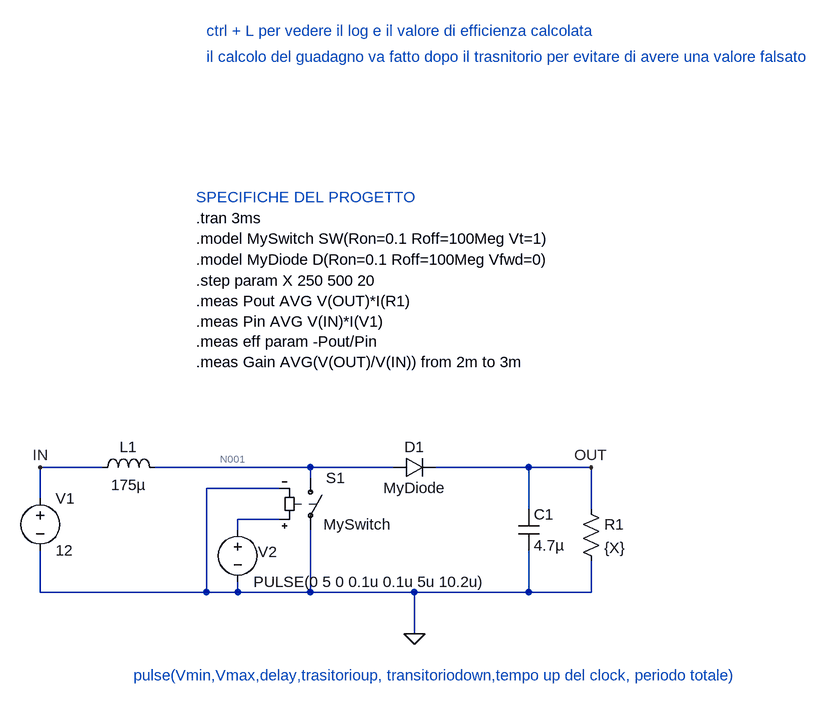
[diagram p0: schematic boost_ideale.asc]
boost_ideale.asc, the LTspice schematic file:
Version 4
SHEET 1 1372 680
WIRE -1552 80 -1648 80
WIRE -1232 80 -1472 80
WIRE -1104 80 -1232 80
WIRE -896 80 -1040 80
WIRE -800 80 -896 80
WIRE -1232 96 -1232 80
WIRE -1280 112 -1392 112
WIRE -1648 128 -1648 80
WIRE -896 144 -896 80
WIRE -800 144 -800 80
WIRE -1280 160 -1344 160
WIRE -1344 176 -1344 160
WIRE -1648 272 -1648 208
WIRE -1392 272 -1392 112
WIRE -1392 272 -1648 272
WIRE -1344 272 -1344 256
WIRE -1344 272 -1392 272
WIRE -1232 272 -1232 176
WIRE -1232 272 -1344 272
WIRE -1072 272 -1232 272
WIRE -896 272 -896 208
WIRE -896 272 -1072 272
WIRE -800 272 -800 224
WIRE -800 272 -896 272
WIRE -1072 336 -1072 272
FLAG -1072 336 0
FLAG -800 80 OUT
FLAG -1648 80 IN
SYMBOL cap -912 144 R0
SYMATTR InstName C1
SYMATTR Value 4.7µ
SYMBOL ind -1568 96 R270
WINDOW 0 32 56 VTop 2
WINDOW 3 5 56 VBottom 2
SYMATTR InstName L1
SYMATTR Value 175µ
SYMBOL diode -1104 96 R270
WINDOW 0 32 32 VTop 2
WINDOW 3 0 32 VBottom 2
SYMATTR InstName D1
SYMATTR Value MyDiode
SYMBOL res -816 128 R0
SYMATTR InstName R1
SYMATTR Value {X}
SYMBOL voltage -1648 112 R0
WINDOW 123 0 0 Left 0
WINDOW 39 0 0 Left 0
SYMATTR InstName V1
SYMATTR Value 12
SYMBOL sw -1232 80 R0
WINDOW 3 20 88 Left 2
SYMATTR InstName S1
SYMATTR Value MySwitch
SYMBOL voltage -1344 160 R0
WINDOW 123 0 0 Left 0
WINDOW 39 0 0 Left 0
WINDOW 0 31 50 Left 2
SYMATTR InstName V2
SYMATTR Value PULSE(0 5 0 0.1u 0.1u 5u 10.2u)
TEXT -1408 -304 Left 2 !.tran 3ms
TEXT -1408 -272 Left 2 !.model MySwitch SW(Ron=0.1 Roff=100Meg Vt=1)
TEXT -1408 -240 Left 2 !.model MyDiode D(Ron=0.1 Roff=100Meg Vfwd=0)
TEXT -1408 -336 Left 2 ;SPECIFICHE DEL PROGETTO
TEXT -1504 400 Left 2 ;pulse(Vmin,Vmax,delay,trasitorioup, transitoriodown,tempo up del clock, periodo totale)
TEXT -1408 -208 Left 2 !.step param X 250 500 20
TEXT -1408 -176 Left 2 !.meas Pout AVG V(OUT)*I(R1)\n.meas Pin AVG V(IN)*I(V1)\n.meas eff param -Pout/Pin\n.meas Gain AVG(V(OUT)/V(IN)) from 2m to 3m
TEXT -1392 -592 Left 2 ;ctrl + L per vedere il log e il valore di efficienza calcolata
TEXT -1392 -552 Left 2 ;il calcolo del guadagno va fatto dopo il trasnitorio per evitare di avere una valore falsato

The netlist it stands for:
* boost_ideale.asc
C1 OUT 0 4.7µ
L1 IN N001 175µ
D1 N001 OUT MyDiode
R1 OUT 0 {X}
V1 IN 0 12
S1 N001 0 N002 0 MySwitch
V2 N002 0 PULSE(0 5 0 0.1u 0.1u 5u 10.2u)
.model D D
.lib standard.dio
.tran 3ms
.model MySwitch SW(Ron=0.1 Roff=100Meg Vt=1)
.model MyDiode D(Ron=0.1 Roff=100Meg Vfwd=0)
* SPECIFICHE DEL PROGETTO
* pulse(Vmin,Vmax,delay,trasitorioup, transitoriodown,tempo up del clock, periodo totale)
.step param X 250 500 20
.meas Pout AVG V(OUT)*I(R1)
.meas Pin AVG V(IN)*I(V1)
.meas eff param -Pout/Pin
.meas Gain AVG(V(OUT)/V(IN)) from 2m to 3m
* ctrl + L per vedere il log e il valore di efficienza calcolata
* il calcolo del guadagno va fatto dopo il trasnitorio per evitare di avere una valore falsato
.backanno
.end

* Results of the author's LTspice run, read from the files saved beside the schematic
* Operating Point (first step), zero values left out:
*   x = 250 
*   V(out) = 12 V
*   V(in) = 12 V
*   V(n001) = 12 V
*   I(D1) = 47.98 mA
*   I(L1) = 47.98 mA
*   I(R1) = 47.98 mA
*   I(S1) = -120 nA
*   I(V1) = -47.98 mA
* From the log:
*   Measurement: pout
*     step  AVG(v(out)*i(r1))  FROM  TO
*        1  2.68021  0  0.003
*        2  2.54783  0  0.003
*        3  2.47066  0  0.003
*        4  2.40674  0  0.003
*        5  2.34826  0  0.003
*        6  2.29392  0  0.003
*        7  2.24296  0  0.003
*        8  2.19491  0  0.003
*        9  2.14979  0  0.003
*       10  2.10693  0  0.003
*       11  2.06601  0  0.003
*       12  2.02698  0  0.003
*       13  1.98965  0  0.003
*       14  1.9714  0  0.003
*   Measurement: pin
*     step  AVG(v(in)*i(v1))  FROM  TO
*        1  -3.04303  0  0.003
*        2  -2.914  0  0.003
*        3  -2.8512  0  0.003
*        4  -2.80993  0  0.003
*        5  -2.77395  0  0.003
*        6  -2.74216  0  0.003
*        7  -2.71384  0  0.003
*        8  -2.68836  0  0.003
*        9  -2.66575  0  0.003
*       10  -2.64531  0  0.003
*       11  -2.62669  0  0.003
*       12  -2.60977  0  0.003
*       13  -2.5944  0  0.003
*       14  -2.58704  0  0.003
*   Measurement: eff
*     step  -pout/pin
*        1  0.88077
*        2  0.87434
*        3  0.866531
*        4  0.856511
*        5  0.846541
*        6  0.836539
*        7  0.82649
*        8  0.816446
*        9  0.806446
*       10  0.796477
*       11  0.786542
*       12  0.776687
*       13  0.766903
*       14  0.762031
*   Measurement: gain
*     step  AVG(v(out)/v(in))  FROM  TO
*        1  2.01873  0.002  0.003
*        2  2.01884  0.002  0.003
*        3  2.06069  0.002  0.003
*        4  2.11116  0.002  0.003
*        5  2.16075  0.002  0.003
*        6  2.20913  0.002  0.003
*        7  2.2564  0.002  0.003
*        8  2.30234  0.002  0.003
*        9  2.34691  0.002  0.003
*       10  2.39033  0.002  0.003
*       11  2.4324  0.002  0.003
*       12  2.47317  0.002  0.003
*       13  2.51275  0.002  0.003
*       14  2.53208  0.002  0.003